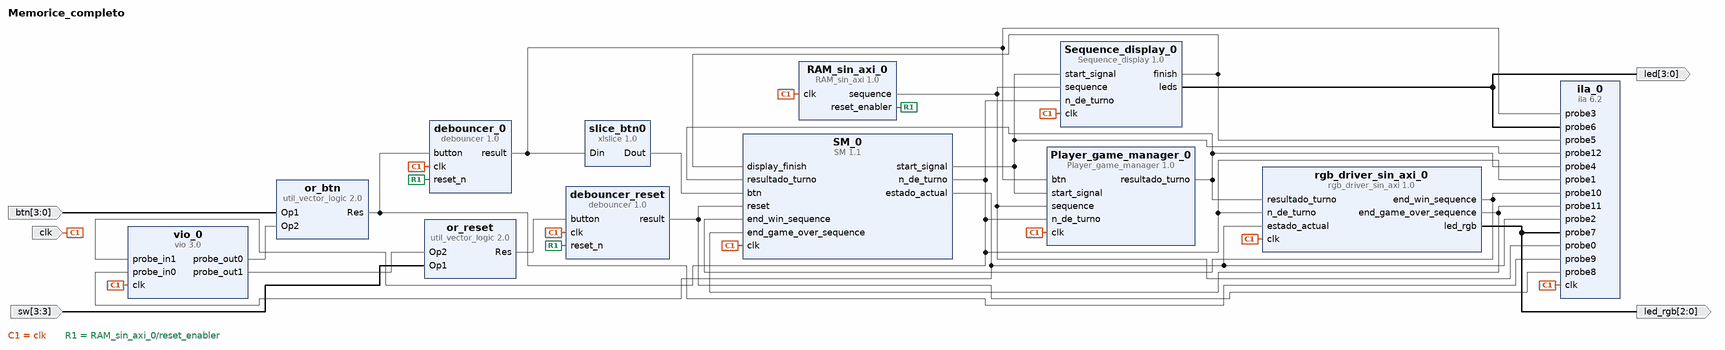
[diagram p0: block diagram of the top level]
# Vivado block design Memorice_completo, xc7z010clg400-1, Vivado 2020.1
create_bd_design Memorice_completo

create_bd_port -dir I -from 3 -to 0 btn
create_bd_port -dir I -type clk clk
create_bd_port -dir O -from 3 -to 0 led
create_bd_port -dir O -from 2 -to 0 led_rgb
create_bd_port -dir I -from 3 -to 3 sw

create_bd_cell -type ip -vlnv xilinx.com:ip:ila:6.2 ila_0
set_property -dict [list \
  CONFIG.C_ENABLE_ILA_AXI_MON false \
  CONFIG.C_MONITOR_TYPE Native \
  CONFIG.C_NUM_OF_PROBES 13 \
  CONFIG.C_PROBE0_WIDTH 32 \
  CONFIG.C_PROBE10_WIDTH 1 \
  CONFIG.C_PROBE11_WIDTH 1 \
  CONFIG.C_PROBE12_WIDTH 1 \
  CONFIG.C_PROBE1_WIDTH 4 \
  CONFIG.C_PROBE2_WIDTH 2 \
  CONFIG.C_PROBE3_WIDTH 4 \
  CONFIG.C_PROBE4_WIDTH 2 \
  CONFIG.C_PROBE5_WIDTH 1 \
  CONFIG.C_PROBE6_WIDTH 4 \
  CONFIG.C_PROBE7_WIDTH 3 \
  CONFIG.C_PROBE8_WIDTH 1 \
  CONFIG.C_PROBE9_WIDTH 4 \
] [get_bd_cells ila_0]
create_bd_cell -type ip -vlnv xilinx.com:ip:vio:3.0 vio_0
set_property -dict [list \
  CONFIG.C_NUM_PROBE_IN 2 \
  CONFIG.C_NUM_PROBE_OUT 2 \
  CONFIG.C_PROBE_OUT0_INIT_VAL 0x0 \
  CONFIG.C_PROBE_OUT0_WIDTH 4 \
  CONFIG.C_PROBE_OUT1_INIT_VAL 0x0 \
  CONFIG.C_PROBE_OUT1_WIDTH 1 \
] [get_bd_cells vio_0]
create_bd_cell -type ip -vlnv xilinx.com:ip:util_vector_logic:2.0 or_btn
set_property -dict {CONFIG.C_OPERATION or CONFIG.C_SIZE 4} [get_bd_cells or_btn]
create_bd_cell -type ip -vlnv xilinx.com:ip:util_vector_logic:2.0 or_reset
set_property -dict {CONFIG.C_OPERATION or CONFIG.C_SIZE 1} [get_bd_cells or_reset]
create_bd_cell -type ip -vlnv xilinx.com:user:RAM_sin_axi:1.0 RAM_sin_axi_0
create_bd_cell -type ip -vlnv xilinx.com:ip:xlslice:1.0 slice_btn0
set_property -dict {CONFIG.DIN_FROM 0 CONFIG.DIN_TO 0 CONFIG.DIN_WIDTH 4 CONFIG.DOUT_WIDTH 1} [get_bd_cells slice_btn0]
create_bd_cell -type ip -vlnv xilinx.com:user:SM:1.1 SM_0
create_bd_cell -type ip -vlnv xilinx.com:user:debouncer:1.0 debouncer_0
create_bd_cell -type ip -vlnv xilinx.com:user:debouncer:1.0 debouncer_reset
set_property -dict {CONFIG.WIDTH 1} [get_bd_cells debouncer_reset]
create_bd_cell -type ip -vlnv xilinx.com:user:Sequence_display:1.0 Sequence_display_0
create_bd_cell -type ip -vlnv xilinx.com:user:rgb_driver_sin_axi:1.0 rgb_driver_sin_axi_0
create_bd_cell -type ip -vlnv xilinx.com:user:Player_game_manager:1.0 Player_game_manager_0

# ---- connections ----

connect_bd_net [get_bd_pins SM_0/n_de_turno] \
  [get_bd_pins ila_0/probe1] [get_bd_pins vio_0/probe_in1] [get_bd_pins Sequence_display_0/n_de_turno] \
  [get_bd_pins rgb_driver_sin_axi_0/n_de_turno] [get_bd_pins Player_game_manager_0/n_de_turno]
connect_bd_net [get_bd_pins debouncer_0/result] [get_bd_pins ila_0/probe3] [get_bd_pins slice_btn0/Din] [get_bd_pins Player_game_manager_0/btn]
connect_bd_net -net clk_0_1 [get_bd_ports clk] \
  [get_bd_pins ila_0/clk] [get_bd_pins vio_0/clk] [get_bd_pins RAM_sin_axi_0/clk] [get_bd_pins SM_0/clk] \
  [get_bd_pins debouncer_0/clk] [get_bd_pins debouncer_reset/clk] [get_bd_pins Sequence_display_0/clk] \
  [get_bd_pins rgb_driver_sin_axi_0/clk] [get_bd_pins Player_game_manager_0/clk]
connect_bd_net [get_bd_pins Sequence_display_0/leds] [get_bd_ports led] [get_bd_pins ila_0/probe6]
connect_bd_net [get_bd_pins Player_game_manager_0/resultado_turno] \
  [get_bd_pins ila_0/probe4] [get_bd_pins SM_0/resultado_turno] [get_bd_pins rgb_driver_sin_axi_0/resultado_turno]
connect_bd_net [get_bd_pins Sequence_display_0/finish] [get_bd_pins ila_0/probe5] [get_bd_pins SM_0/display_finish]
connect_bd_net [get_bd_pins SM_0/start_signal] \
  [get_bd_pins ila_0/probe12] [get_bd_pins Sequence_display_0/start_signal] [get_bd_pins Player_game_manager_0/start_signal]
connect_bd_net [get_bd_pins SM_0/estado_actual] \
  [get_bd_pins ila_0/probe2] [get_bd_pins vio_0/probe_in0] [get_bd_pins rgb_driver_sin_axi_0/estado_actual]
connect_bd_net [get_bd_pins rgb_driver_sin_axi_0/end_win_sequence] [get_bd_pins ila_0/probe10] [get_bd_pins SM_0/end_win_sequence]
connect_bd_net [get_bd_pins rgb_driver_sin_axi_0/end_game_over_sequence] [get_bd_pins ila_0/probe11] [get_bd_pins SM_0/end_game_over_sequence]
connect_bd_net [get_bd_pins RAM_sin_axi_0/reset_enabler] [get_bd_pins debouncer_0/reset_n] [get_bd_pins debouncer_reset/reset_n]
connect_bd_net [get_bd_pins RAM_sin_axi_0/sequence] \
  [get_bd_pins ila_0/probe0] [get_bd_pins Sequence_display_0/sequence] [get_bd_pins Player_game_manager_0/sequence]
connect_bd_net -net rgb_driver_led_rgb [get_bd_pins rgb_driver_sin_axi_0/led_rgb] [get_bd_ports led_rgb] [get_bd_pins ila_0/probe7]
connect_bd_net -net btn_fisico [get_bd_ports btn] [get_bd_pins or_btn/Op1]
connect_bd_net -net btn_virtual [get_bd_pins vio_0/probe_out0] [get_bd_pins or_btn/Op2]
connect_bd_net -net btn_combinado [get_bd_pins or_btn/Res] [get_bd_pins ila_0/probe9] [get_bd_pins debouncer_0/button]
connect_bd_net -net sw3_fisico [get_bd_ports sw] [get_bd_pins or_reset/Op1]
connect_bd_net -net reset_virtual [get_bd_pins vio_0/probe_out1] [get_bd_pins or_reset/Op2]
connect_bd_net -net reset_combinado [get_bd_pins or_reset/Res] [get_bd_pins debouncer_reset/button]
connect_bd_net -net reset_limpio [get_bd_pins debouncer_reset/result] [get_bd_pins ila_0/probe8] [get_bd_pins SM_0/reset]
connect_bd_net -net btn0_accion [get_bd_pins slice_btn0/Dout] [get_bd_pins SM_0/btn]

validate_bd_design
save_bd_design
